# Altium schematic sheet ESenseFE-Power-Singal-Interface.SchDoc
size A
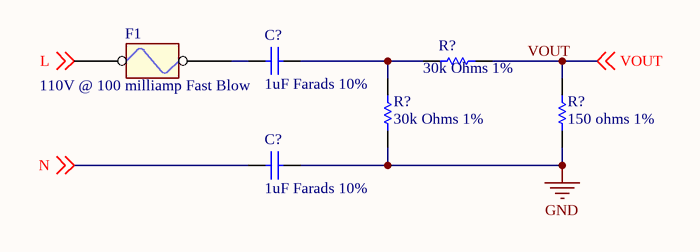
[diagram p0: ESenseFE-Power-Singal-Interface.SchDoc]

## Parts
(Parts that share a designator on the sheet are numbered #1, #2 ... from top to bottom, then left to right.)
C?#1  1uF Farads 10%  [Y2-Caps-Epocs-1uF-10%]
C?#2  1uF Farads 10%  [Y2-Caps-Epocs-1uF-10%]
F1  110V @ 100 milliamp Fast Blow  [WICKMANN/WK0011-ND]
R?#1  30k Ohms 1%  [SM/R_2512]
R?#2  30k Ohms 1%  [SM/R_2512]
R?#3  150 ohms 1%  [SM/R_2512]

## Nets
GND: C?#2.2 R?#2.1 R?#3.1
L: F1.1 ; off-sheet L
N: C?#2.1 ; off-sheet N
VOUT: R?#1.1 R?#3.2 ; off-sheet VOUT
NetC?#1_1: C?#1.1 F1.2
NetC?#1_2: C?#1.2 R?#1.2 R?#2.2

## Library data of the parts
C?#1 C?#2 = 2202: Y2 Caps 1uF Epocs; mfrName: EPCOS; mfrPartNum: B32026B3105K; Obsolete: False; Temp_Max: 0; Type: All Parts; TypeNotes: Applies to all parts in the database; Label: 1uF; PartID: 2202; Extra_Description: Y2 Caps 1uF Epocs; URL_Image: http://www.mouser.com/images/epcos/images/812007111135.jpg; URL_Datasheet: http://www.epcos.com/inf/20/20/db/fc_2009/Y2_B32021_026.pdf; Date_Created: 5/7/2011 9:37:20 PM; Date_LastModified: 5/7/2011 9:37:20 PM; Verified: False; RoHS: True; Temp_Min: 0
F1 = 1045: FUSEHOLDER OPEN 5X20MM PC MNT; mfrName: Wickmann USA, Inc.; mfrPartNum: 6490000100; Extra_Description: Wickmann USA, Inc. / TypeHolder / Fuse Size5mm x 20mm / MountingPCB / SpecificationsMiniature / MaterialThermoplastic, Black / Other Names19649 / 649 / WK0011; Type: Fuseholders; PartID: 1045; URL_Image: http://media.digikey.com/photos/Wickmann%20Photos/6490000100_sml.jpg; URL_Datasheet: http://www.digikey.com/scripts/DkSearch/dksus.dll?Pname?Name=WK0011-ND&Site=US; Date_Created: 8/1/2004 3:23:57 AM; Date_LastModified: 8/21/2009 1:12:53 AM; Verified: False
R?#1 R?#2 = 2203: single components passive components resistors; mfrName: Panasonic; mfrPartNum: ERJ-1TNF3002U; Value: 1K; Extra_Description: RES 30.0K OHM 1W 1% 2512 SMD / Mounting Type: ``Surface Mount`` / Case / Package: ``2512`` / Packaging: ``Cut Tape (CT)`` / Lead-Free Status: ``Lead Free`` / RoHS: ``Compliant`` / Size-Width: { / ``uncertainty_minus``: null, / ``value``: 0.0032, / ``uncertainty_plus``: null / } / Resistance: { / ``uncertainty_minus``: null, / ``value``: 30000.0, / ``uncertainty_plus``: null / } / Size-Height: { / ``uncertainty_minus``: null, / ``value``: 0.0006, / ``uncertainty_plus``: null / } / Size-Length: { / ``uncertainty_minus``: null, / ``value``: 0.0064, / ``uncertainty_plus``: null / } / Resistance Tolerance: { / ``max_value``: 1.0, / ``max_uncertainty_plus``: null, / ``min_value``: -1.0, / ``min_uncertainty_plus``: null, / ``max_uncertainty_minus``: null / } / Operating Temperature: { / ``max_value``: 125.0, / ``max_uncertainty_plus``: null, / ``min_value``: null, / ``min_uncertainty_plus``: null, / ``max_uncertainty_minus``: null / }; Obsolete: False; Temp_Max: 0; TypeNotes: Applies to all parts in the database; Published: 8-Jun-2000; LatestRevisionDate: 17-Jul-2002; LatestRevisionNote: Re-released for DXP Platform.; PackageReference: AXIAL-0.3; Publisher: Altium Limited; PartID: 2203; URL_Image: http://cdn.sigma.octopart.com/8892366/image/Panasonic-ERJ-1TNF3002U.jpg; URL_Datasheet: http://industrial.panasonic.com/www-data/pdf/AOA0000/AOA0000PE3.pdf; Date_Created: 5/7/2011 10:12:00 PM; Date_LastModified: 5/7/2011 10:12:00 PM; Verified: False; RoHS: True; Temp_Min: 0; Type: All Parts
R?#3 = 2204: single components passive components resistors; mfrName: Panasonic; mfrPartNum: ERJ-1TNF15R0U; Value: 1K; Extra_Description: RES 15.0 OHM 1W 1% 2512 SMD / Mounting Type: ``Surface Mount`` / Case / Package: ``2512`` / Packaging: ``Cut Tape (CT)`` / Lead-Free Status: ``Lead Free`` / RoHS: ``Compliant`` / Size-Width: { / ``uncertainty_minus``: null, / ``value``: 0.0032, / ``uncertainty_plus``: null / } / Resistance: { / ``uncertainty_minus``: null, / ``value``: 15.0, / ``uncertainty_plus``: null / } / Size-Height: { / ``uncertainty_minus``: null, / ``value``: 0.0006, / ``uncertainty_plus``: null / } / Size-Length: { / ``uncertainty_minus``: null, / ``value``: 0.0064, / ``uncertainty_plus``: null / } / Resistance Tolerance: { / ``max_value``: 1.0, / ``max_uncertainty_plus``: null, / ``min_value``: -1.0, / ``min_uncertainty_plus``: null, / ``max_uncertainty_minus``: null / } / Operating Temperature: { / ``max_value``: 125.0, / ``max_uncertainty_plus``: null, / ``min_value``: null, / ``min_uncertainty_plus``: null, / ``max_uncertainty_minus``: null / }; Obsolete: False; Temp_Max: 0; TypeNotes: Applies to all parts in the database; Published: 8-Jun-2000; LatestRevisionDate: 17-Jul-2002; LatestRevisionNote: Re-released for DXP Platform.; PackageReference: AXIAL-0.3; Publisher: Altium Limited; PartID: 2204; URL_Image: http://cdn.sigma.octopart.com/8892366/image/Panasonic-ERJ-1TNF15R0U.jpg; URL_Datasheet: http://industrial.panasonic.com/www-data/pdf/AOA0000/AOA0000PE3.pdf; Date_Created: 5/7/2011 10:15:26 PM; Date_LastModified: 5/7/2011 10:15:26 PM; Verified: False; RoHS: True; Temp_Min: 0; Type: All Parts